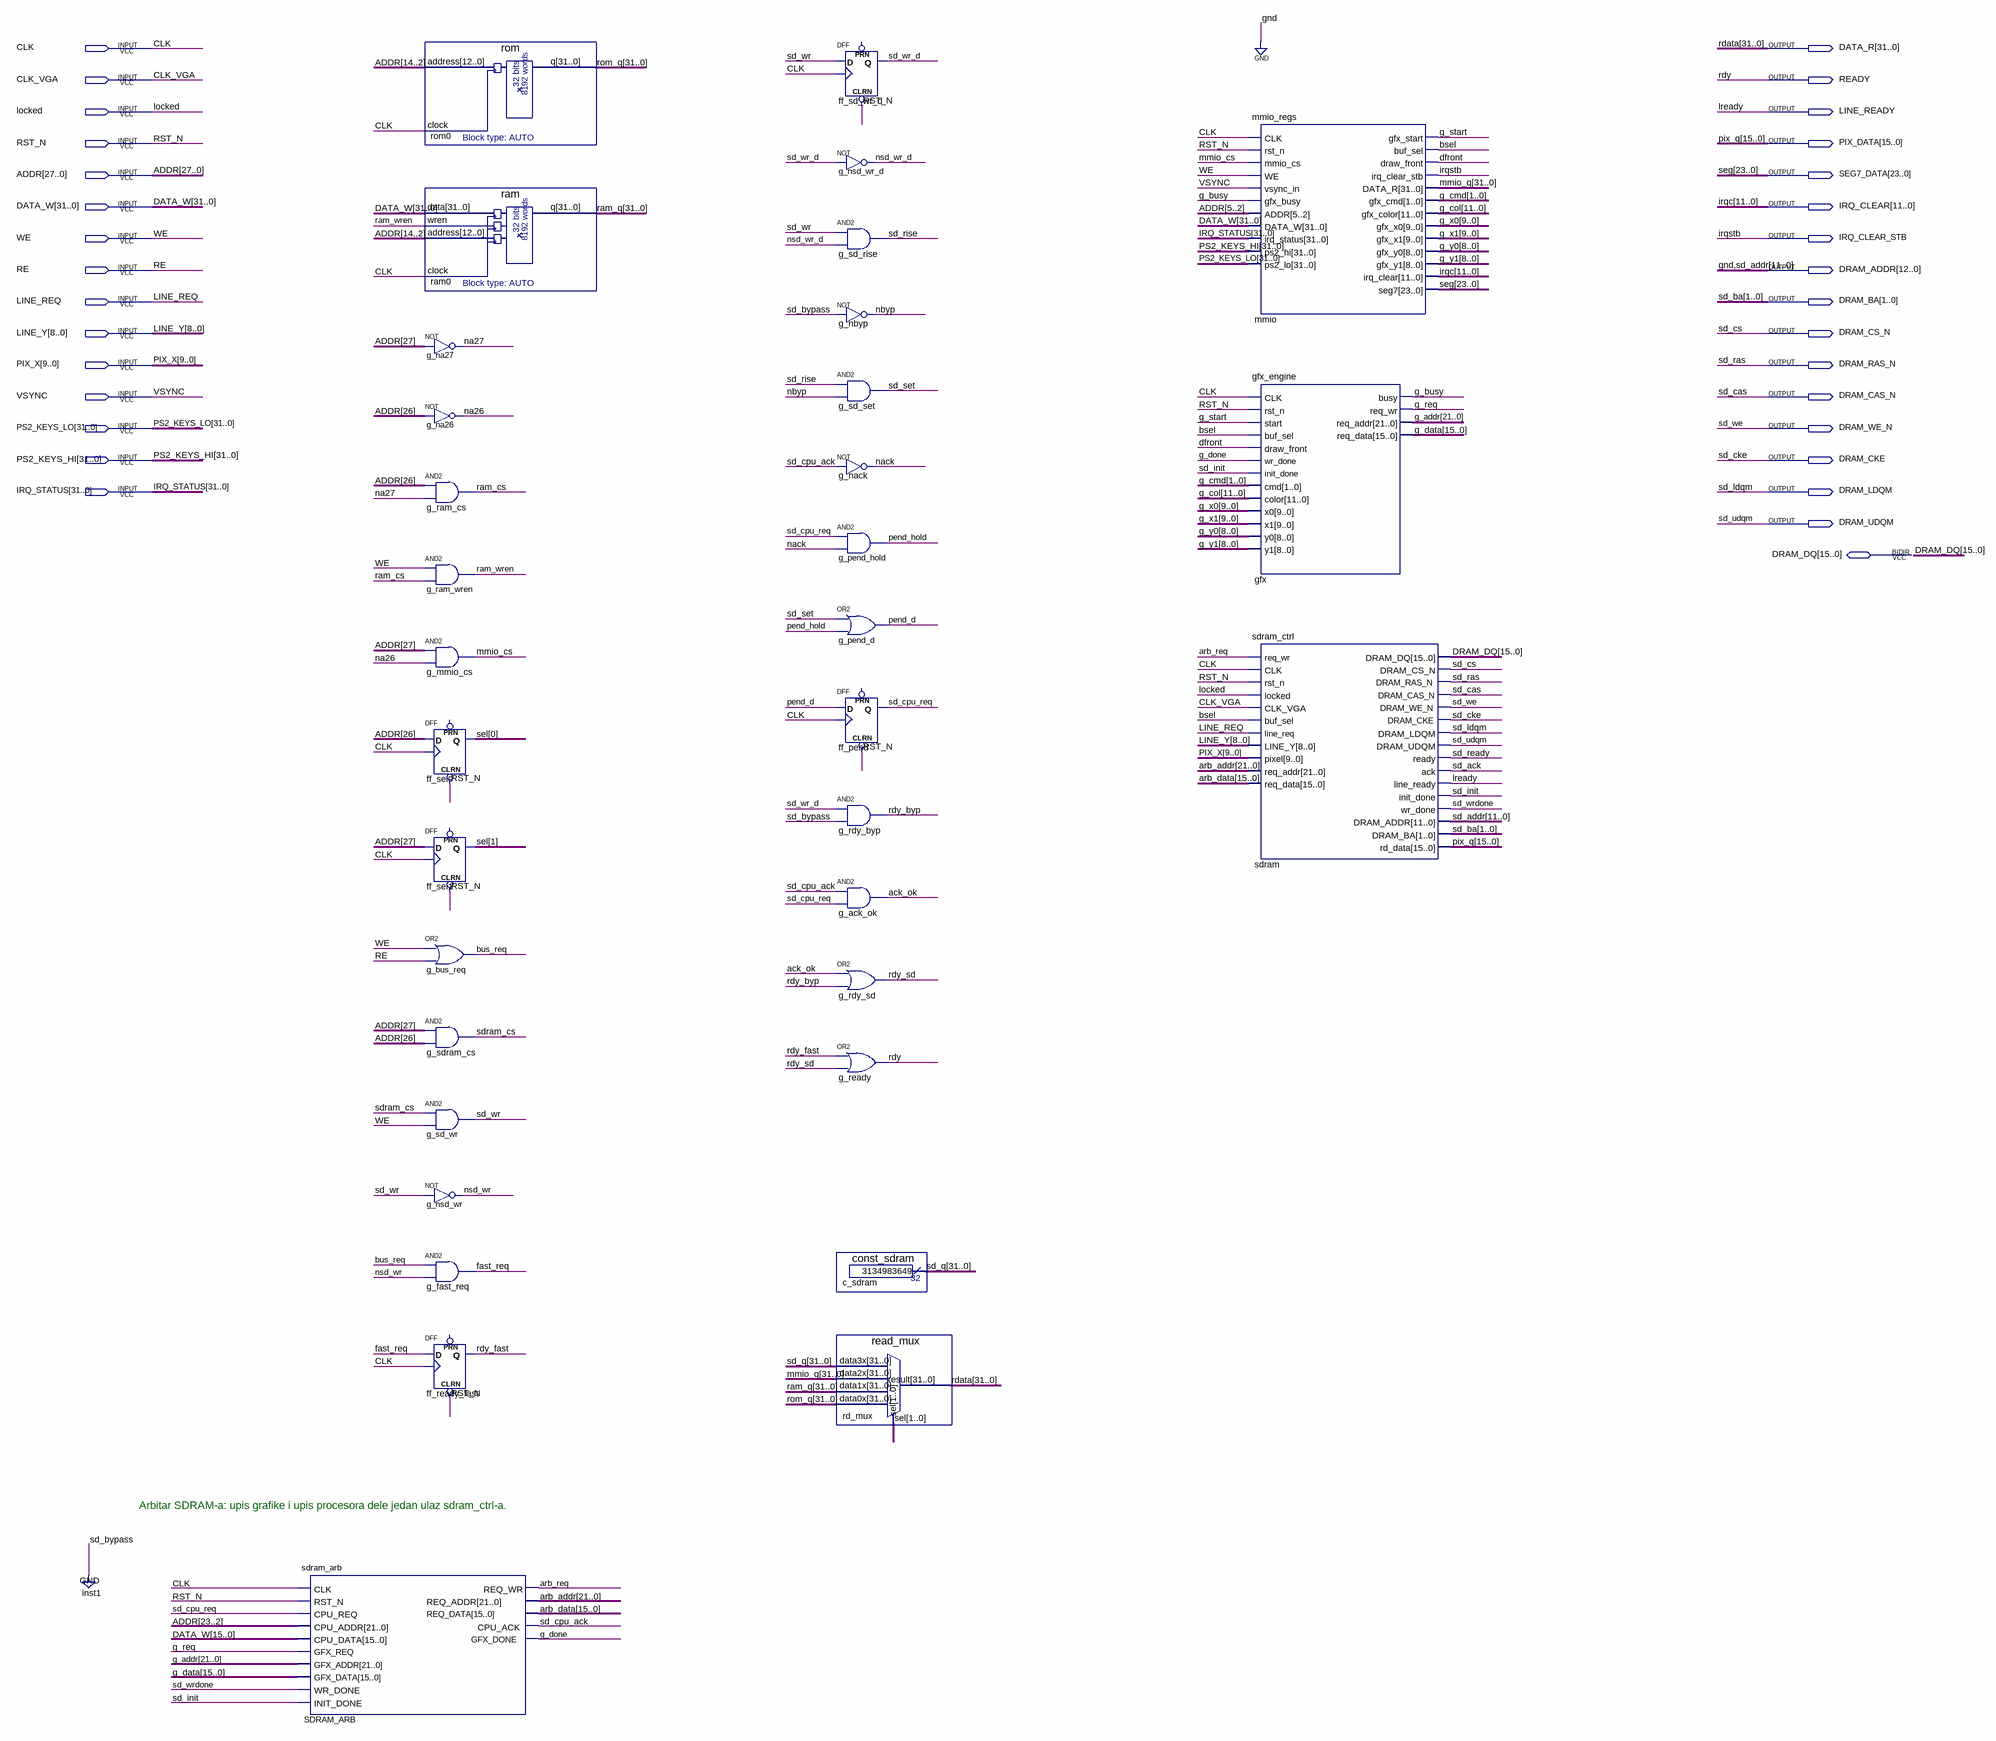
[diagram p0: schematic sheet]
// Quartus schematic mem_top.bdf as structural Verilog: 34 symbols, 32 pins
module mem_top (
  input  CLK,
  input  CLK_VGA,
  input  locked,
  input  RST_N,
  input  [27:0] ADDR,
  input  [31:0] DATA_W,
  input  WE,
  input  RE,
  input  LINE_REQ,
  input  [8:0] LINE_Y,
  input  [9:0] PIX_X,
  input  VSYNC,
  input  [31:0] PS2_KEYS_LO,
  input  [31:0] PS2_KEYS_HI,
  input  [31:0] IRQ_STATUS,
  inout  [15:0] DRAM_DQ,
  output [31:0] DATA_R,
  output READY,
  output LINE_READY,
  output [15:0] PIX_DATA,
  output [23:0] SEG7_DATA,
  output [11:0] IRQ_CLEAR,
  output IRQ_CLEAR_STB,
  output [12:0] DRAM_ADDR,
  output [1:0] DRAM_BA,
  output DRAM_CS_N,
  output DRAM_RAS_N,
  output DRAM_CAS_N,
  output DRAM_WE_N,
  output DRAM_CKE,
  output DRAM_LDQM,
  output DRAM_UDQM
);

  wire ack_ok, arb_req, bsel, bus_req, dfront, fast_req, g_busy, g_done, g_req, g_start, mmio_cs, na26, na27,
       nack, nbyp, nsd_wr, nsd_wr_d, pend_d, pend_hold, ram_cs, ram_wren, rdy_byp, rdy_fast, rdy_sd, sd_ack,
       sd_cpu_ack, sd_cpu_req, sd_init, sd_ready, sd_rise, sd_set, sd_wr, sd_wr_d, sd_wrdone, sdram_cs;
  wire [1:0] g_cmd, sel;
  wire [8:0] g_y0, g_y1;
  wire [9:0] g_x0, g_x1;
  wire [11:0] g_col;
  wire [15:0] arb_data, g_data;
  wire [21:0] arb_addr, g_addr;
  wire [31:0] mmio_q, ram_q, rom_q, sd_q;

  sdram_arb SDRAM_ARB (
    .CLK(CLK), .RST_N(RST_N), .CPU_REQ(sd_cpu_req), .CPU_ADDR(ADDR[23:2]), .CPU_DATA(DATA_W[15:0]),
    .GFX_REQ(g_req), .GFX_ADDR(g_addr), .GFX_DATA(g_data), .WR_DONE(sd_wrdone), .INIT_DONE(sd_init),
    .REQ_WR(arb_req), .REQ_ADDR(arb_addr), .REQ_DATA(arb_data), .CPU_ACK(sd_cpu_ack), .GFX_DONE(g_done));
  rom rom0 (.address(ADDR[14:2]), .clock(CLK), .q(rom_q));
  ram ram0 (.data(DATA_W), .wren(ram_wren), .address(ADDR[14:2]), .clock(CLK), .q(ram_q));
  not g_na27 (na27, ADDR[27]);
  not g_na26 (na26, ADDR[26]);
  and g_ram_cs (ram_cs, ADDR[26], na27);
  and g_ram_wren (ram_wren, WE, ram_cs);
  and g_mmio_cs (mmio_cs, ADDR[27], na26);
  DFF ff_sel0 (.CLRN(RST_N), .CLK(CLK), .D(ADDR[26]), .Q(sel[0]));  // open: PRN
  DFF ff_sel1 (.CLRN(RST_N), .CLK(CLK), .D(ADDR[27]), .Q(sel[1]));  // open: PRN
  or g_bus_req (bus_req, WE, RE);
  and g_sdram_cs (sdram_cs, ADDR[27], ADDR[26]);
  and g_sd_wr (sd_wr, sdram_cs, WE);
  not g_nsd_wr (nsd_wr, sd_wr);
  and g_fast_req (fast_req, bus_req, nsd_wr);
  DFF ff_ready_fast (.CLRN(RST_N), .CLK(CLK), .D(fast_req), .Q(rdy_fast));  // open: PRN
  DFF ff_sd_wr_d (.CLRN(RST_N), .CLK(CLK), .D(sd_wr), .Q(sd_wr_d));  // open: PRN
  not g_nsd_wr_d (nsd_wr_d, sd_wr_d);
  and g_sd_rise (sd_rise, sd_wr, nsd_wr_d);
  not g_nbyp (nbyp, 1'b0);
  and g_sd_set (sd_set, sd_rise, nbyp);
  not g_nack (nack, sd_cpu_ack);
  and g_pend_hold (pend_hold, sd_cpu_req, nack);
  or g_pend_d (pend_d, sd_set, pend_hold);
  DFF ff_pend (.CLRN(RST_N), .CLK(CLK), .D(pend_d), .Q(sd_cpu_req));  // open: PRN
  and g_rdy_byp (rdy_byp, sd_wr_d, 1'b0);
  and g_ack_ok (ack_ok, sd_cpu_ack, sd_cpu_req);
  or g_rdy_sd (rdy_sd, ack_ok, rdy_byp);
  or g_ready (READY, rdy_fast, rdy_sd);
  const_sdram c_sdram (.result(sd_q));
  read_mux rd_mux (.data3x(sd_q), .data2x(mmio_q), .data1x(ram_q), .data0x(rom_q), .sel(sel), .result(DATA_R));
  mmio_regs mmio (
    .CLK(CLK), .rst_n(RST_N), .mmio_cs(mmio_cs), .WE(WE), .vsync_in(VSYNC), .gfx_busy(g_busy),
    .ADDR(ADDR[5:2]), .DATA_W(DATA_W), .irq_status(IRQ_STATUS), .ps2_hi(PS2_KEYS_HI), .ps2_lo(PS2_KEYS_LO),
    .gfx_start(g_start), .buf_sel(bsel), .draw_front(dfront), .irq_clear_stb(IRQ_CLEAR_STB), .DATA_R(mmio_q),
    .gfx_cmd(g_cmd), .gfx_color(g_col), .gfx_x0(g_x0), .gfx_x1(g_x1), .gfx_y0(g_y0), .gfx_y1(g_y1),
    .irq_clear(IRQ_CLEAR), .seg7(SEG7_DATA));
  gfx_engine gfx (
    .CLK(CLK), .rst_n(RST_N), .start(g_start), .buf_sel(bsel), .draw_front(dfront), .wr_done(g_done),
    .init_done(sd_init), .cmd(g_cmd), .color(g_col), .x0(g_x0), .x1(g_x1), .y0(g_y0), .y1(g_y1),
    .busy(g_busy), .req_wr(g_req), .req_addr(g_addr), .req_data(g_data));
  sdram_ctrl sdram (
    .req_wr(arb_req), .CLK(CLK), .rst_n(RST_N), .locked(locked), .CLK_VGA(CLK_VGA), .buf_sel(bsel),
    .line_req(LINE_REQ), .LINE_Y(LINE_Y), .pixel(PIX_X), .req_addr(arb_addr), .req_data(arb_data),
    .DRAM_CS_N(DRAM_CS_N), .DRAM_RAS_N(DRAM_RAS_N), .DRAM_CAS_N(DRAM_CAS_N), .DRAM_WE_N(DRAM_WE_N),
    .DRAM_CKE(DRAM_CKE), .DRAM_LDQM(DRAM_LDQM), .DRAM_UDQM(DRAM_UDQM), .ready(sd_ready), .ack(sd_ack),
    .line_ready(LINE_READY), .init_done(sd_init), .wr_done(sd_wrdone), .DRAM_ADDR(DRAM_ADDR[11:0]),
    .DRAM_BA(DRAM_BA), .rd_data(PIX_DATA), .DRAM_DQ(DRAM_DQ));

  assign DRAM_ADDR[12] = 1'b0;

  // Other names for the same wires on the sheet: irqc[11:0] = IRQ_CLEAR; irqstb = IRQ_CLEAR_STB; lready = LINE_READY;
  //   pix_q[15:0] = PIX_DATA; rdata[31:0] = DATA_R; rdy = READY; sd_addr[11:0] = DRAM_ADDR[11:0];
  //   sd_ba[1:0] = DRAM_BA; sd_cas = DRAM_CAS_N; sd_cke = DRAM_CKE; sd_cs = DRAM_CS_N; sd_ldqm = DRAM_LDQM;
  //   sd_ras = DRAM_RAS_N; sd_udqm = DRAM_UDQM; sd_we = DRAM_WE_N; seg[23:0] = SEG7_DATA

  // Notes on the sheet:
  //   Arbitar SDRAM-a: upis grafike i upis procesora dele jedan ulaz sdram_ctrl-a.
endmodule
